# Altium schematic sheet EPS_Top.SchDoc
size A4; SheetNumber: 1; SheetTotal: 4
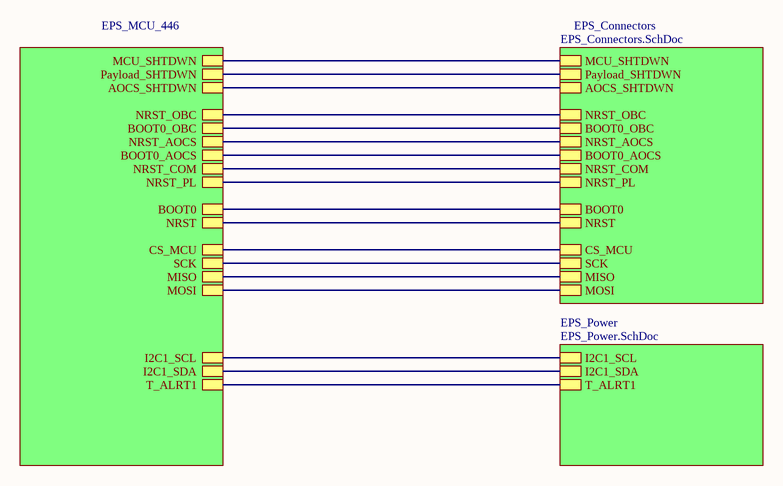
[diagram p0: EPS_Top.SchDoc]

## Sub-sheets
EPS_Connectors = EPS_Connectors.SchDoc: NRST, BOOT0, CS_MCU, SCK, MISO, MOSI, BOOT0_OBC, NRST_OBC, NRST_AOCS, BOOT0_AOCS, NRST_COM, NRST_PL, MCU_SHTDWN, Payload_SHTDWN, AOCS_SHTDWN
EPS_MCU_446 = EPS_MCU.SchDoc: NRST, BOOT0, I2C1_SCL, I2C1_SDA, T_ALRT1, CS_MCU, SCK, MISO, MOSI, BOOT0_OBC, NRST_OBC, NRST_AOCS, BOOT0_AOCS, NRST_COM, NRST_PL, MCU_SHTDWN, Payload_SHTDWN, AOCS_SHTDWN
EPS_Power = EPS_Power.SchDoc: I2C1_SCL, I2C1_SDA, T_ALRT1

## Nets
(unnamed): sheet EPS_Power/I2C1_SCL, sheet EPS_MCU_446/I2C1_SCL
(unnamed): sheet EPS_Power/I2C1_SDA, sheet EPS_MCU_446/I2C1_SDA
(unnamed): sheet EPS_Power/T_ALRT1, sheet EPS_MCU_446/T_ALRT1
(unnamed): sheet EPS_Connectors/NRST, sheet EPS_MCU_446/NRST
(unnamed): sheet EPS_Connectors/BOOT0, sheet EPS_MCU_446/BOOT0
(unnamed): sheet EPS_Connectors/CS_MCU, sheet EPS_MCU_446/CS_MCU
(unnamed): sheet EPS_Connectors/SCK, sheet EPS_MCU_446/SCK
(unnamed): sheet EPS_Connectors/MISO, sheet EPS_MCU_446/MISO
(unnamed): sheet EPS_Connectors/MOSI, sheet EPS_MCU_446/MOSI
(unnamed): sheet EPS_Connectors/BOOT0_OBC, sheet EPS_MCU_446/BOOT0_OBC
(unnamed): sheet EPS_Connectors/NRST_OBC, sheet EPS_MCU_446/NRST_OBC
(unnamed): sheet EPS_Connectors/NRST_AOCS, sheet EPS_MCU_446/NRST_AOCS
(unnamed): sheet EPS_Connectors/BOOT0_AOCS, sheet EPS_MCU_446/BOOT0_AOCS
(unnamed): sheet EPS_Connectors/NRST_COM, sheet EPS_MCU_446/NRST_COM
(unnamed): sheet EPS_Connectors/NRST_PL, sheet EPS_MCU_446/NRST_PL
(unnamed): sheet EPS_Connectors/MCU_SHTDWN, sheet EPS_MCU_446/MCU_SHTDWN
(unnamed): sheet EPS_Connectors/Payload_SHTDWN, sheet EPS_MCU_446/Payload_SHTDWN
(unnamed): sheet EPS_Connectors/AOCS_SHTDWN, sheet EPS_MCU_446/AOCS_SHTDWN